# EAGLE schematic ADC (EAGLE 6.2)
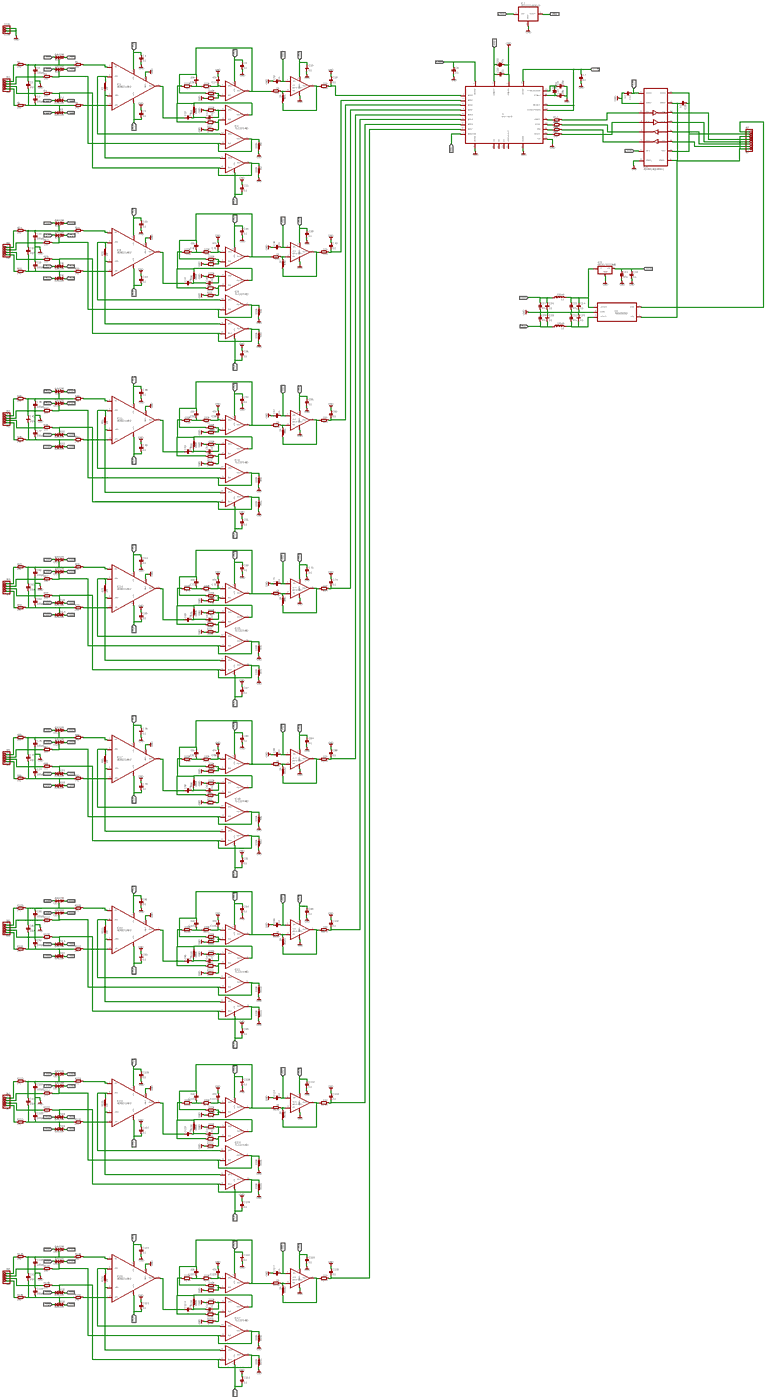
[diagram p0: schematic, sheet 1, overview]
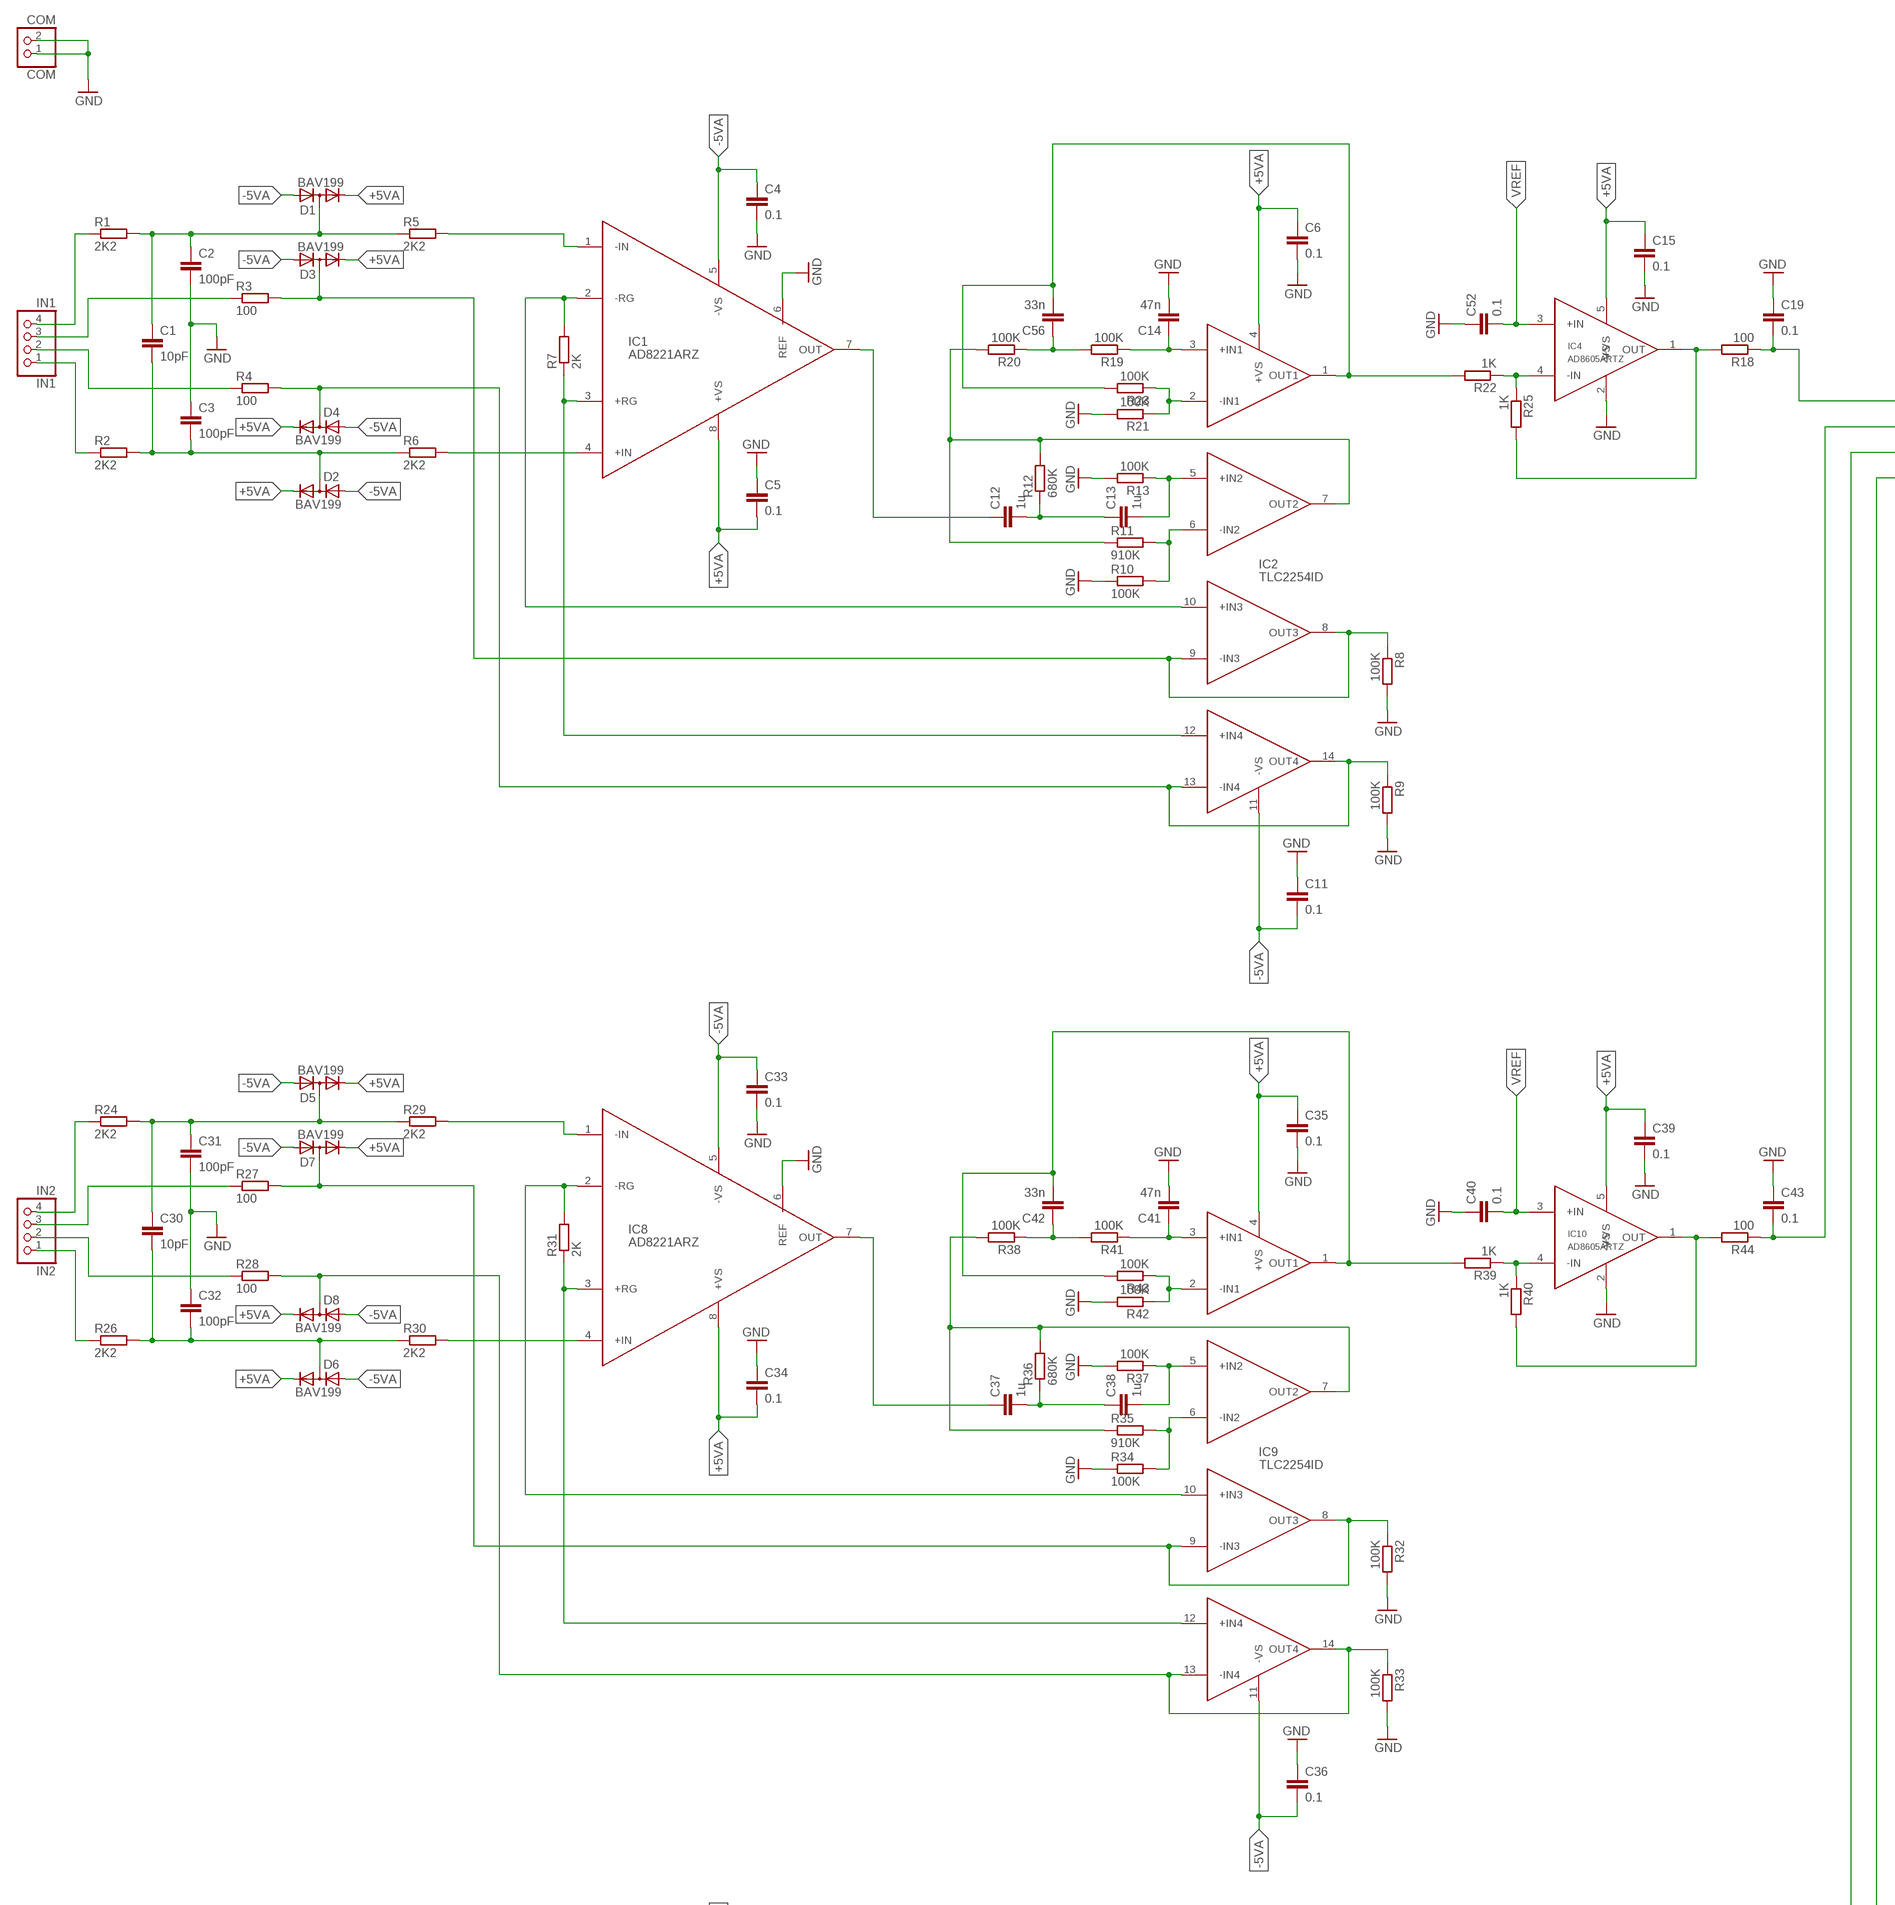
[diagram p1: schematic, sheet 1, part 1 of 5]
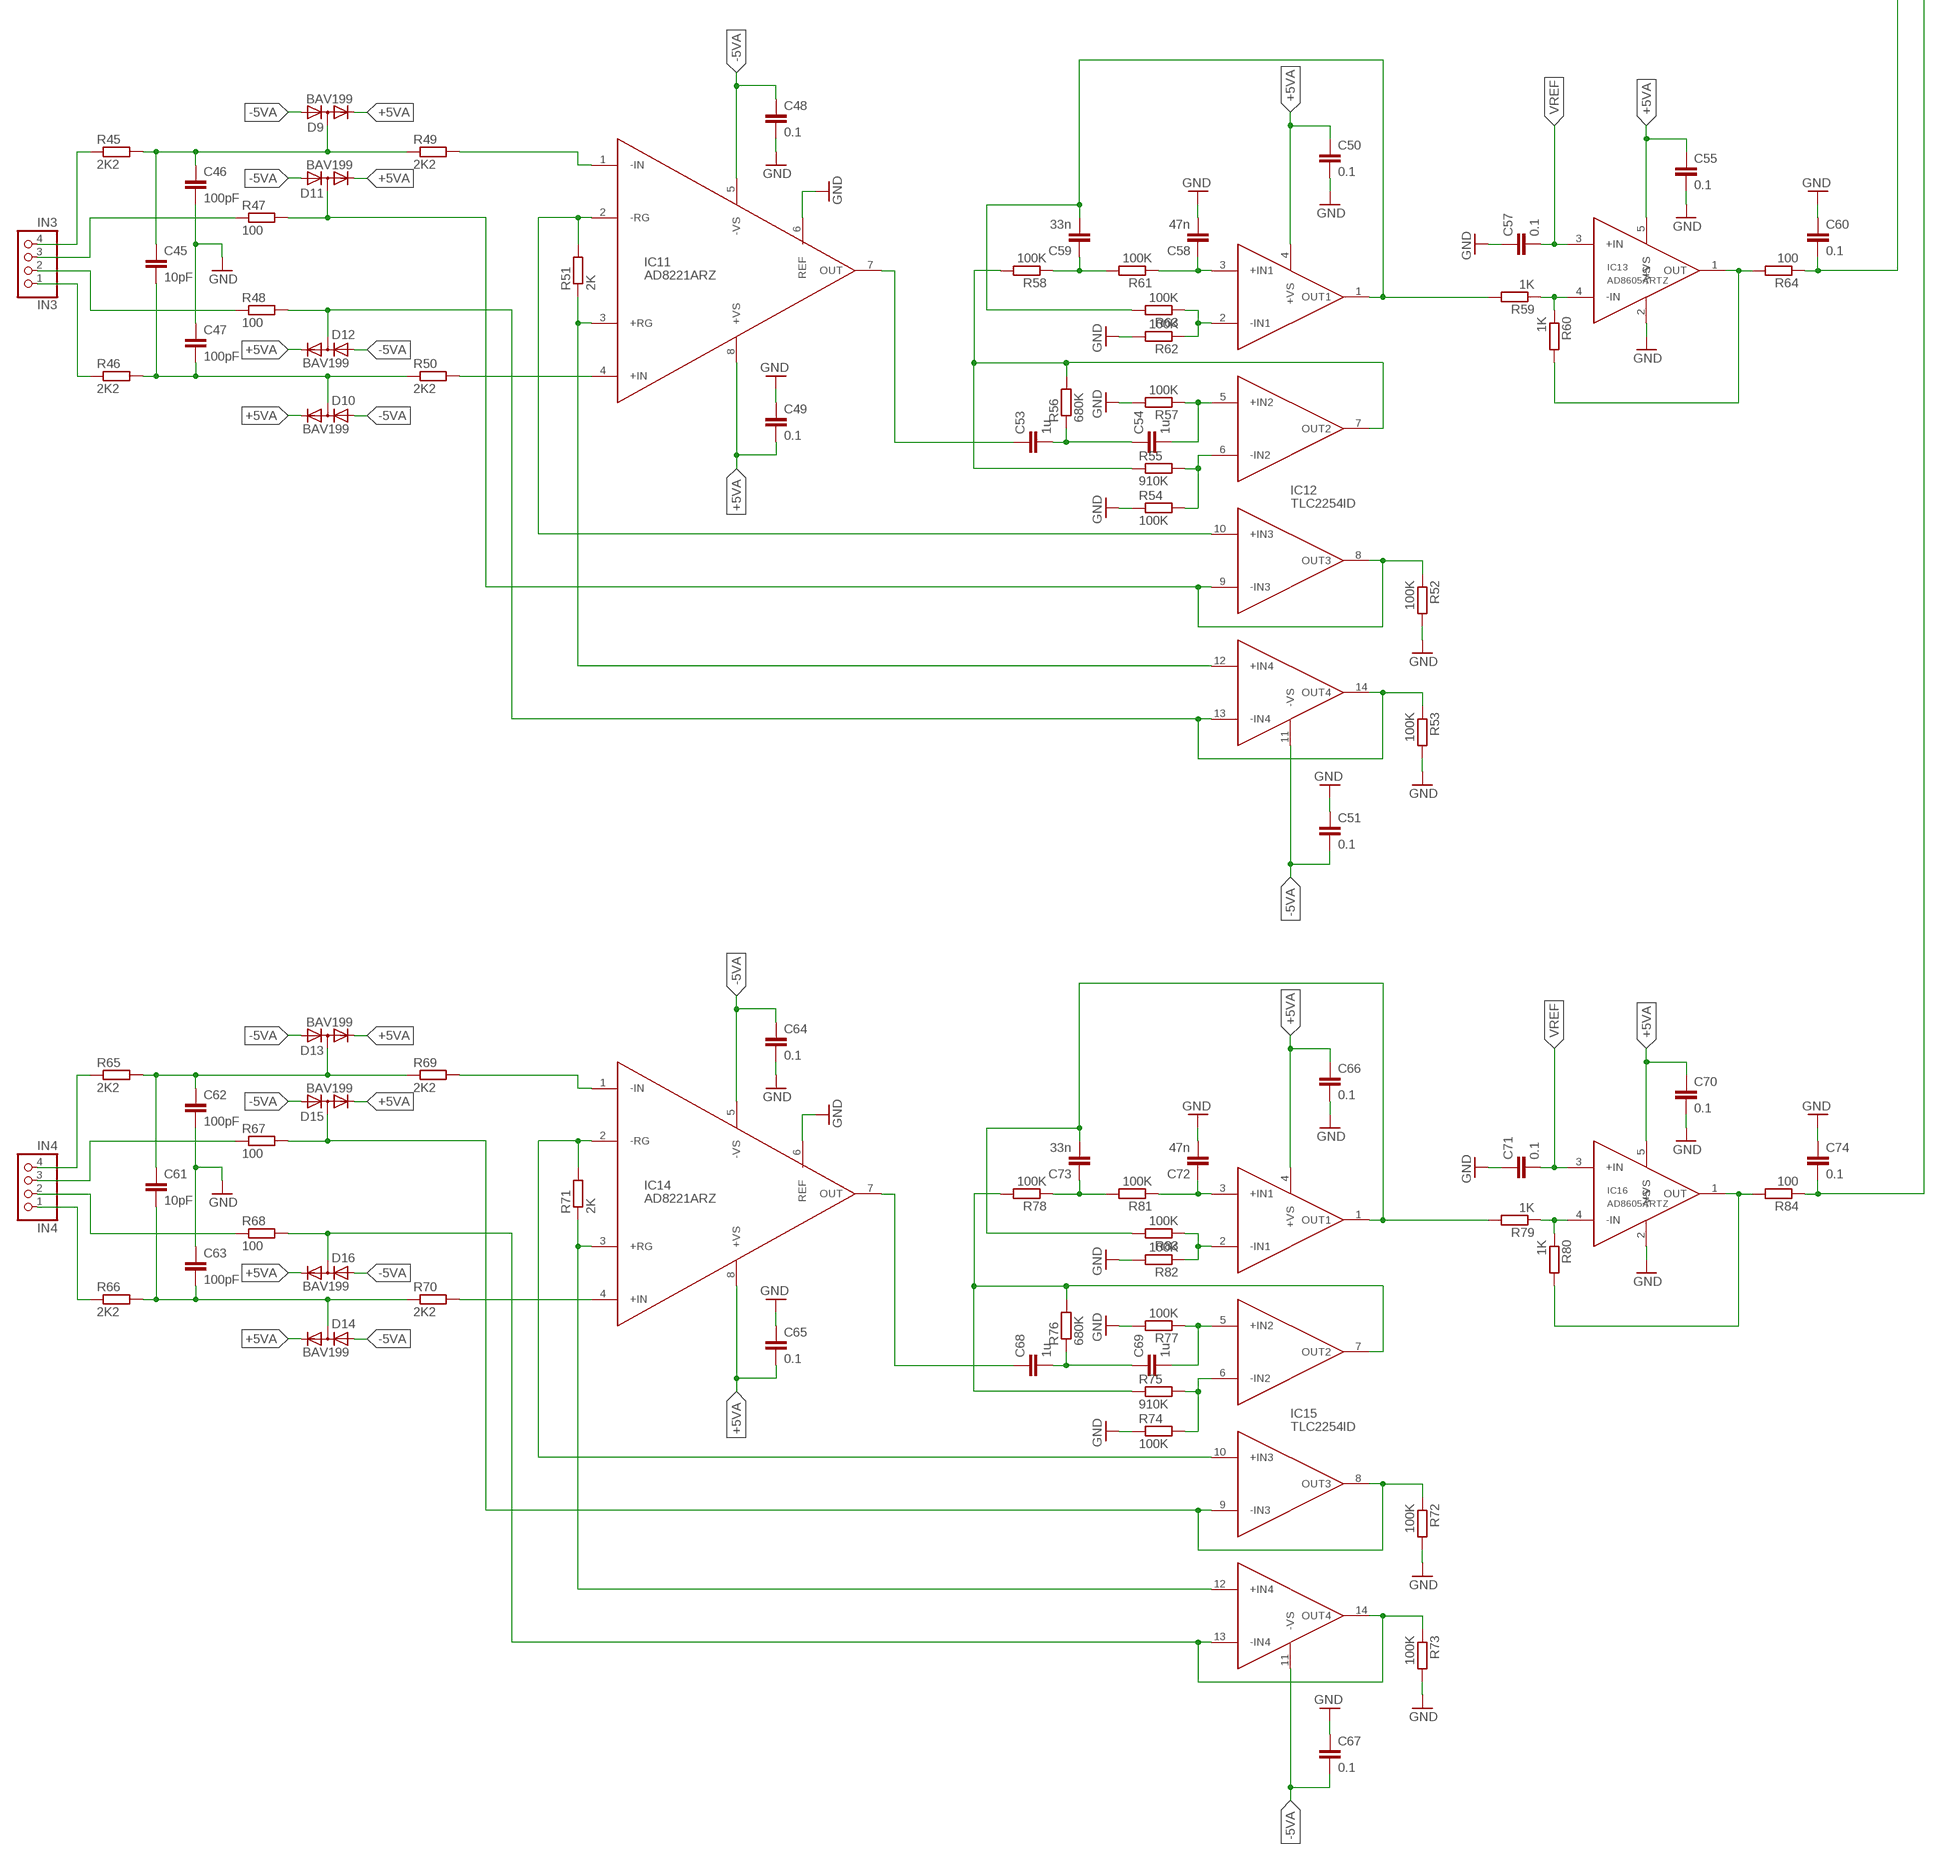
[diagram p2: schematic, sheet 1, part 2 of 5]
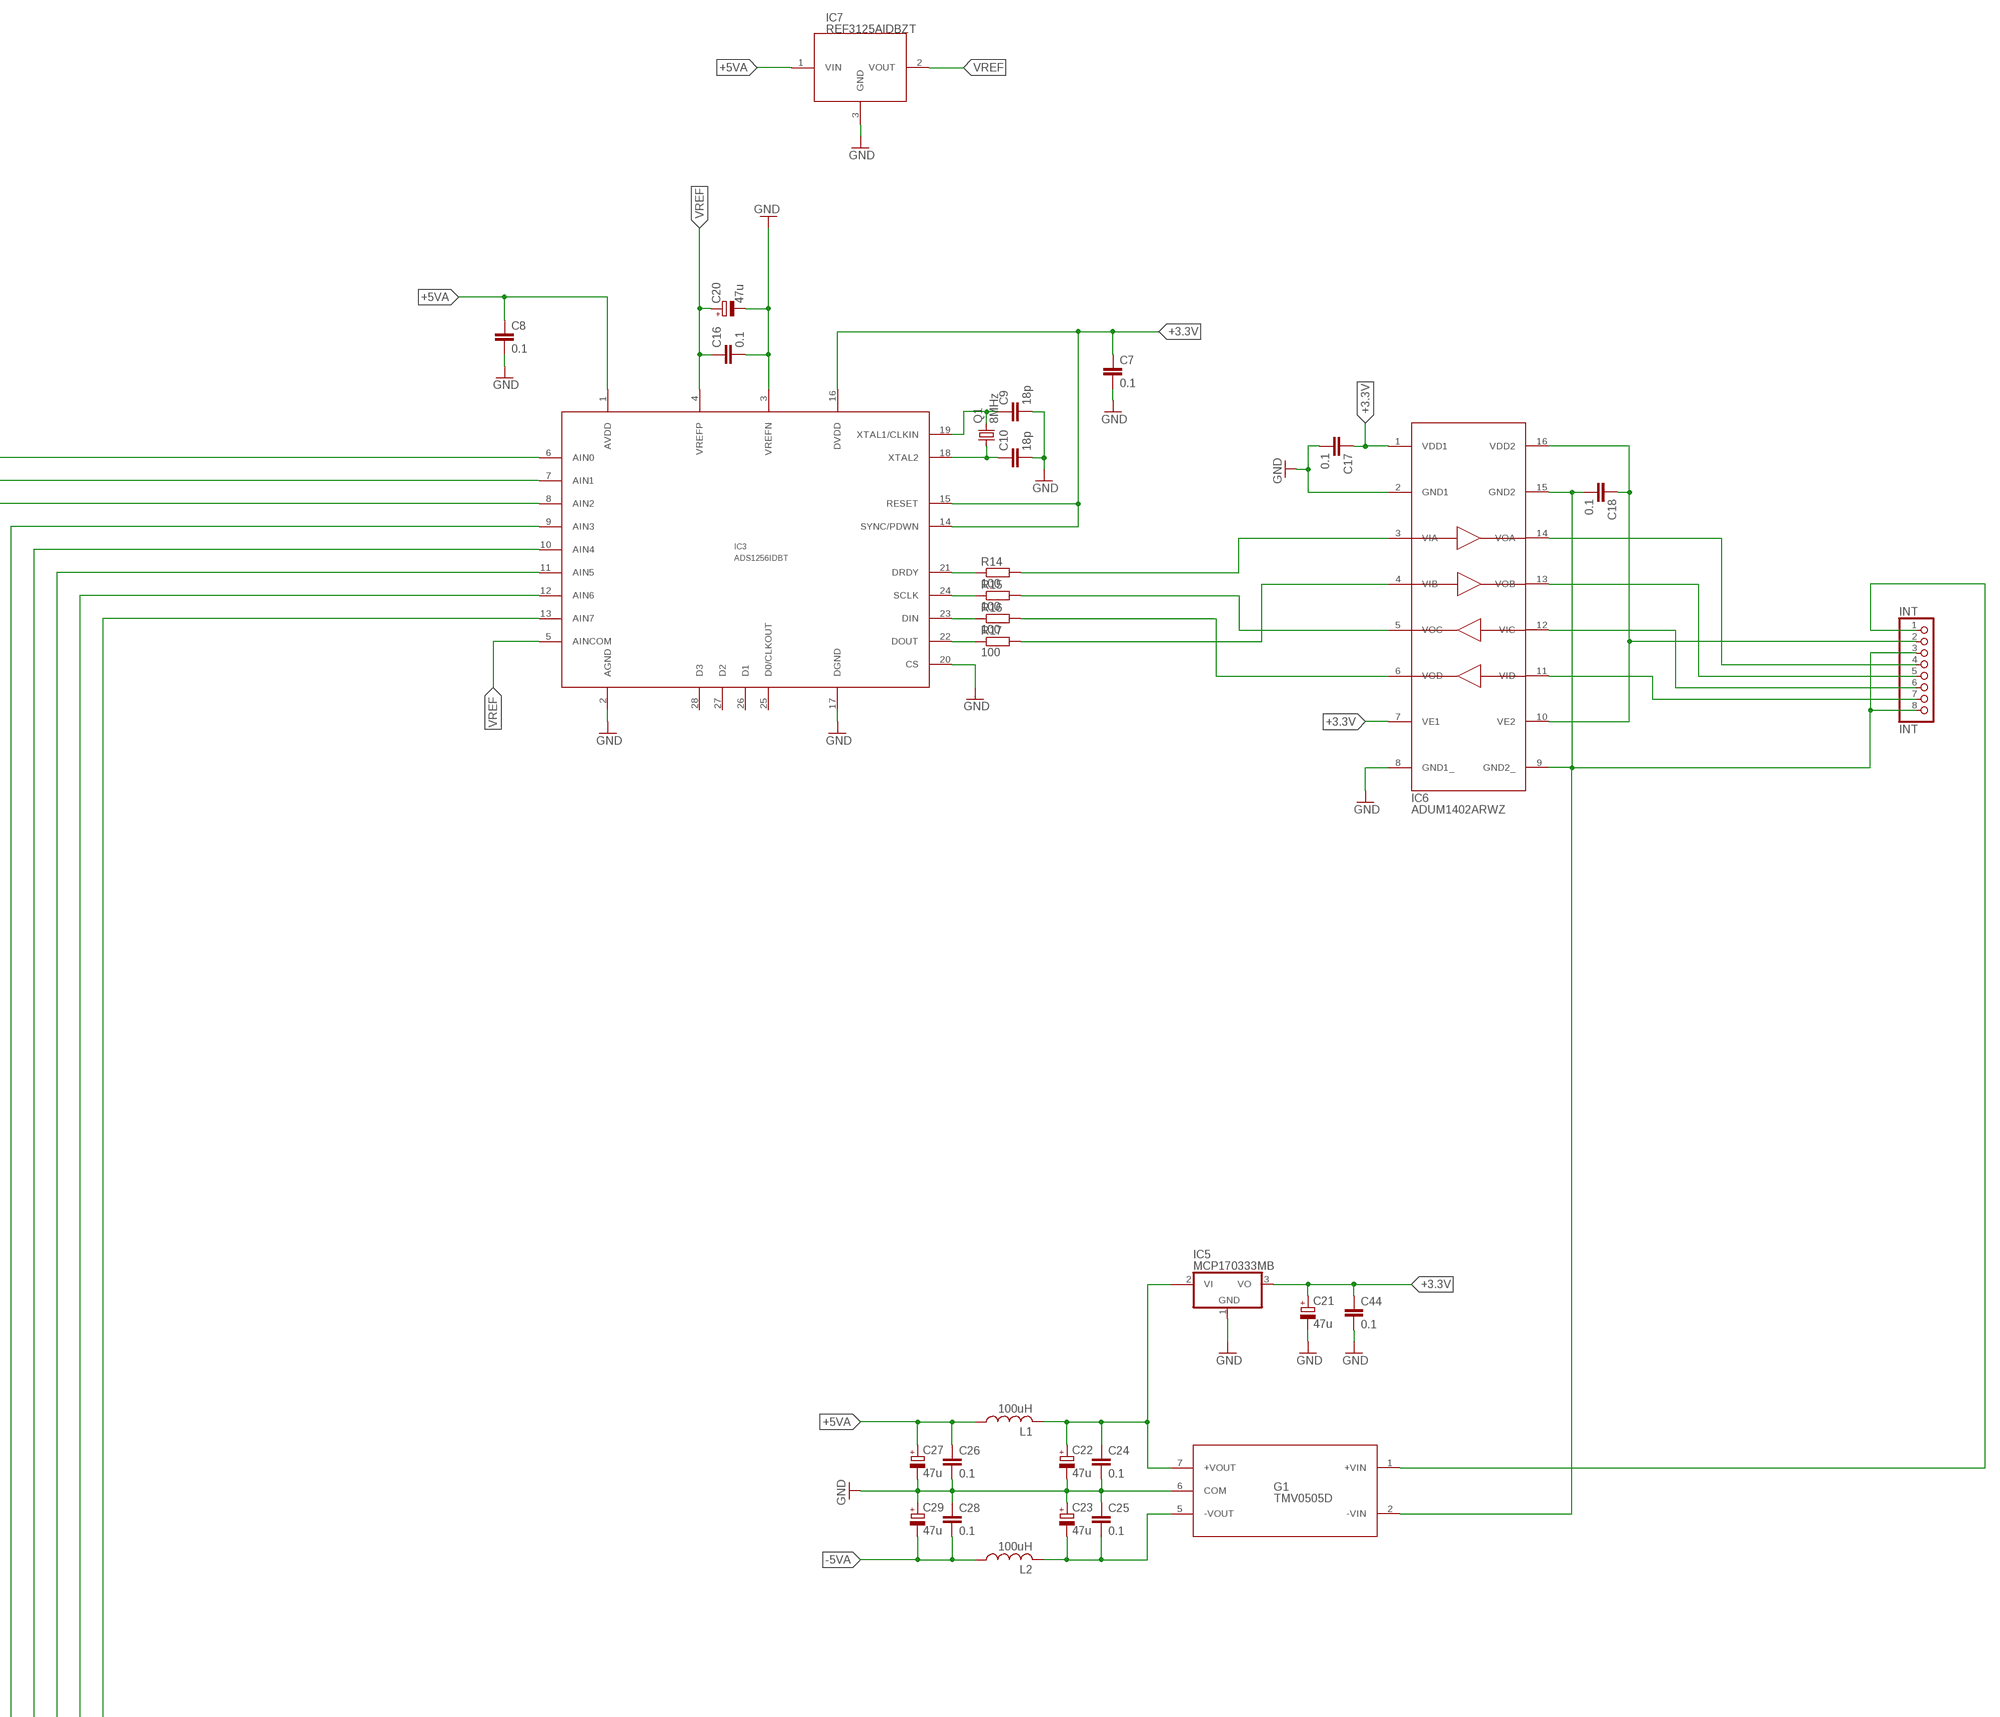
[diagram p3: schematic, sheet 1, part 3 of 5]
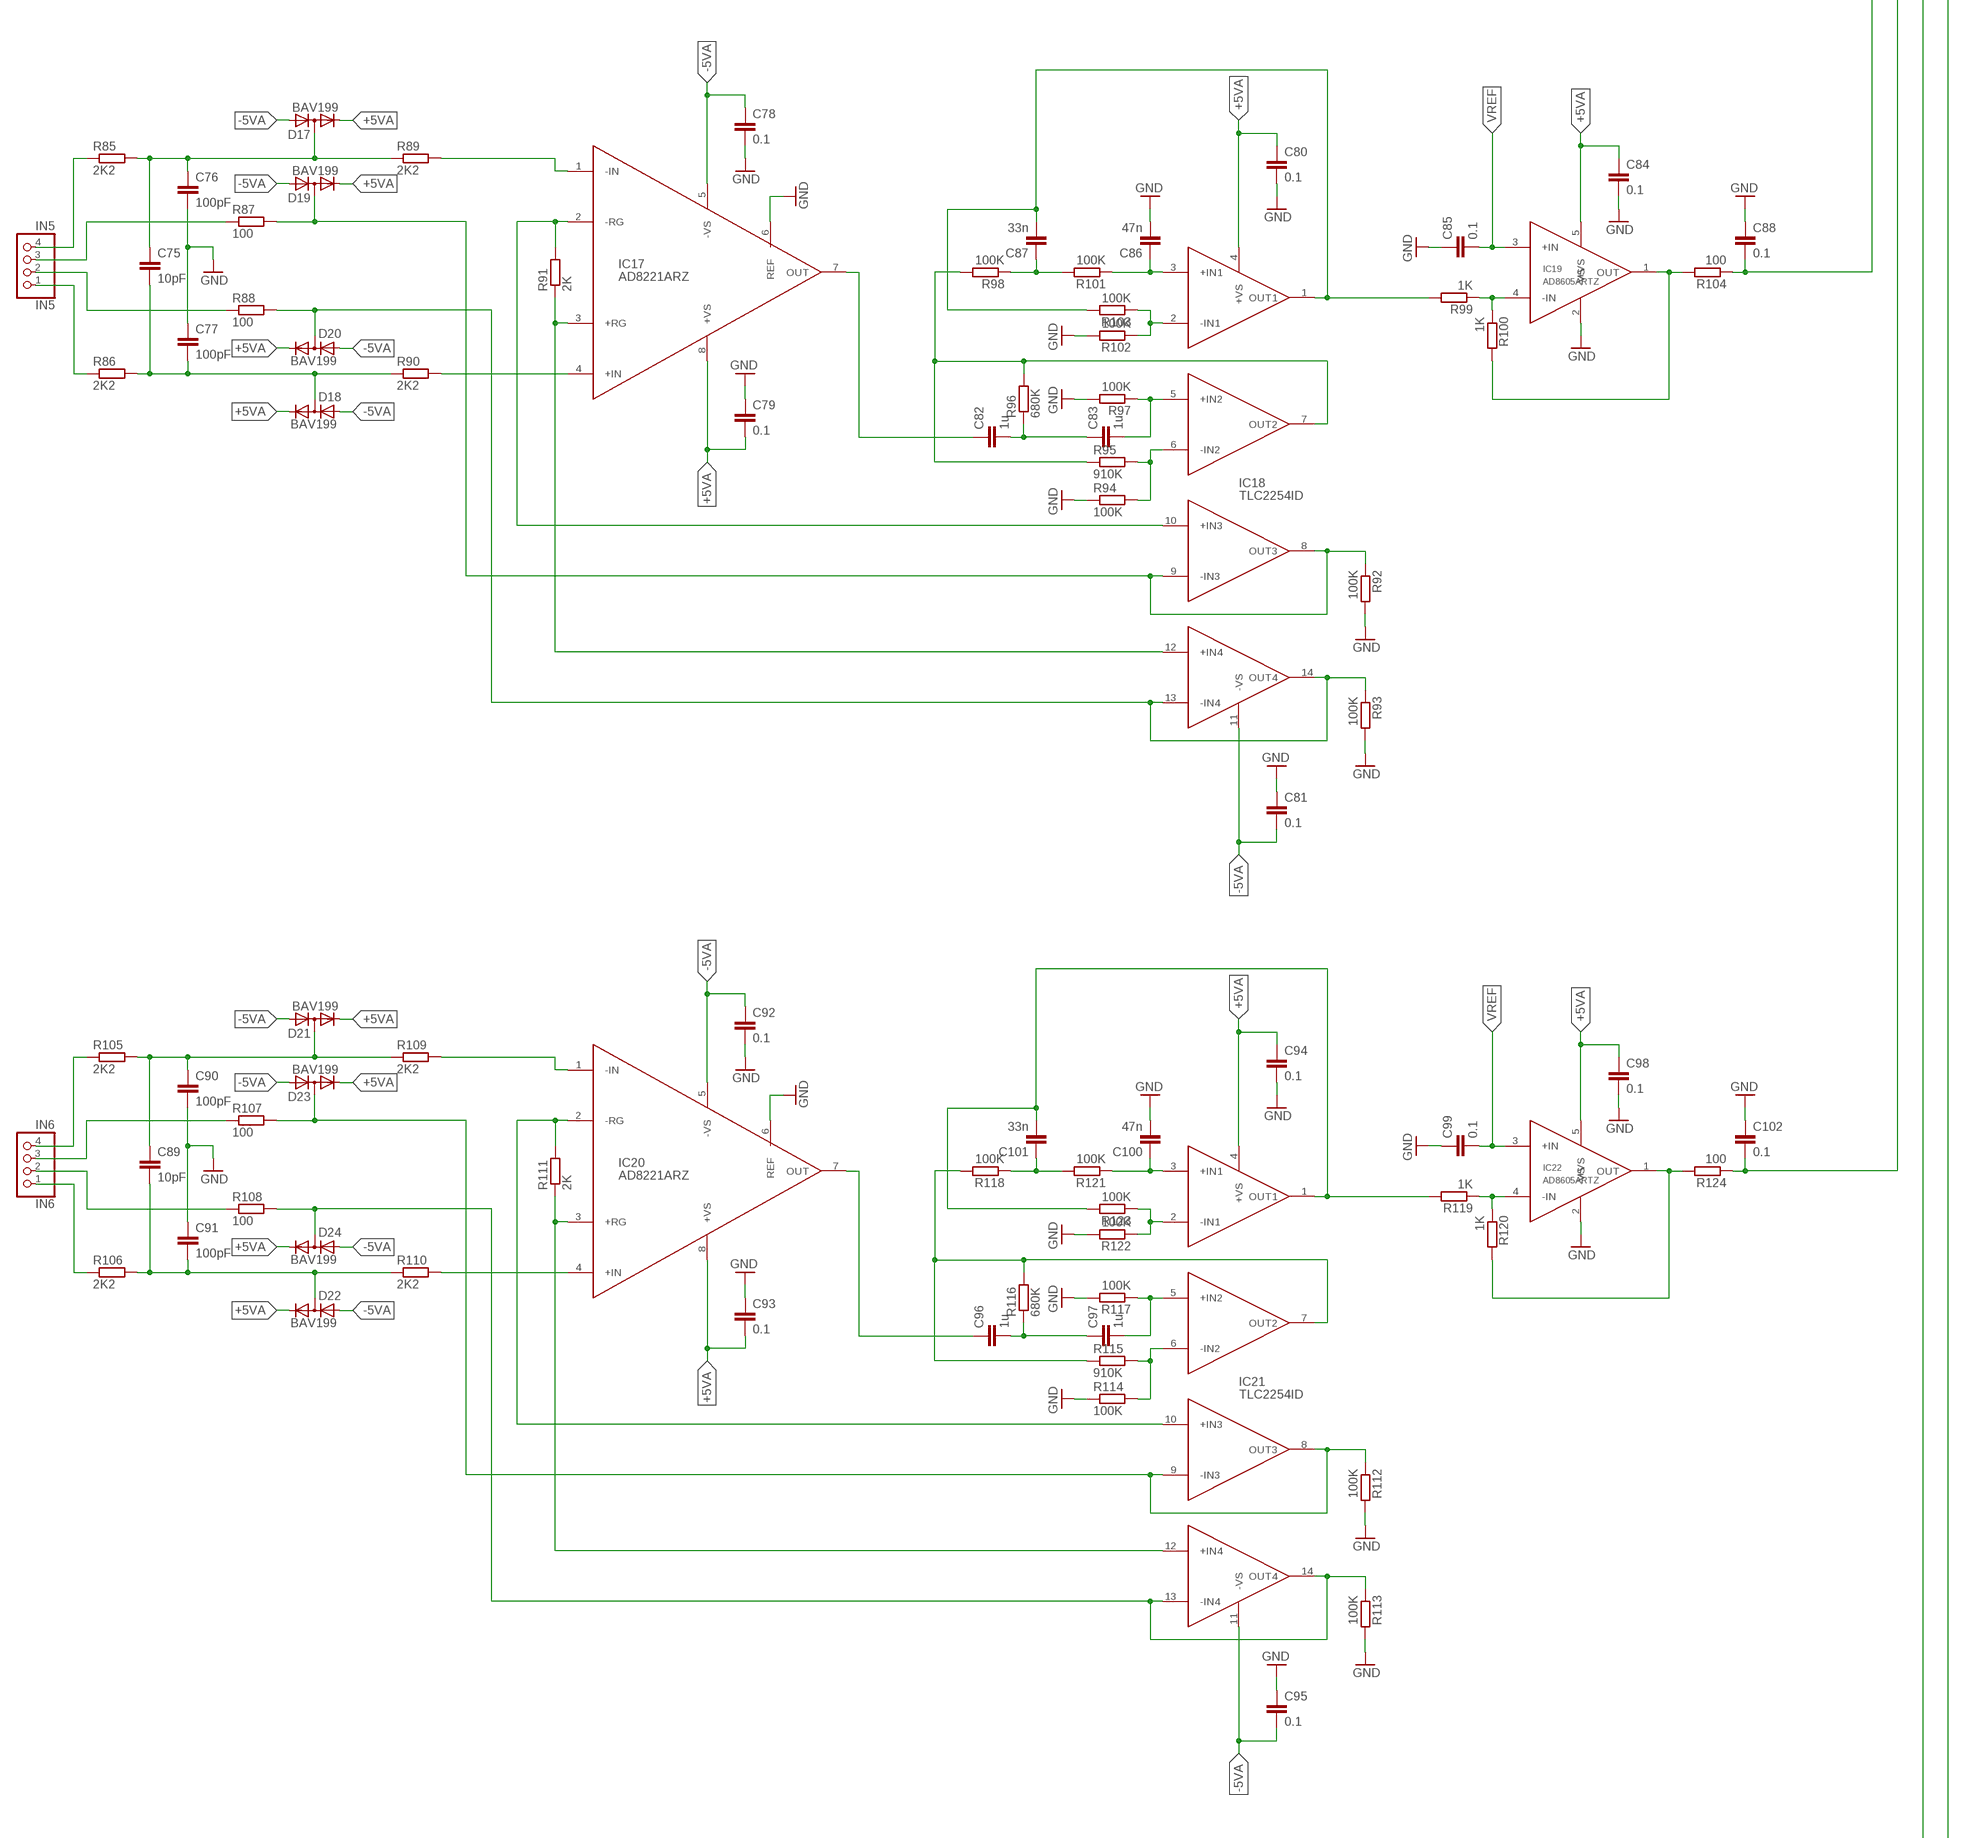
[diagram p4: schematic, sheet 1, part 4 of 5]
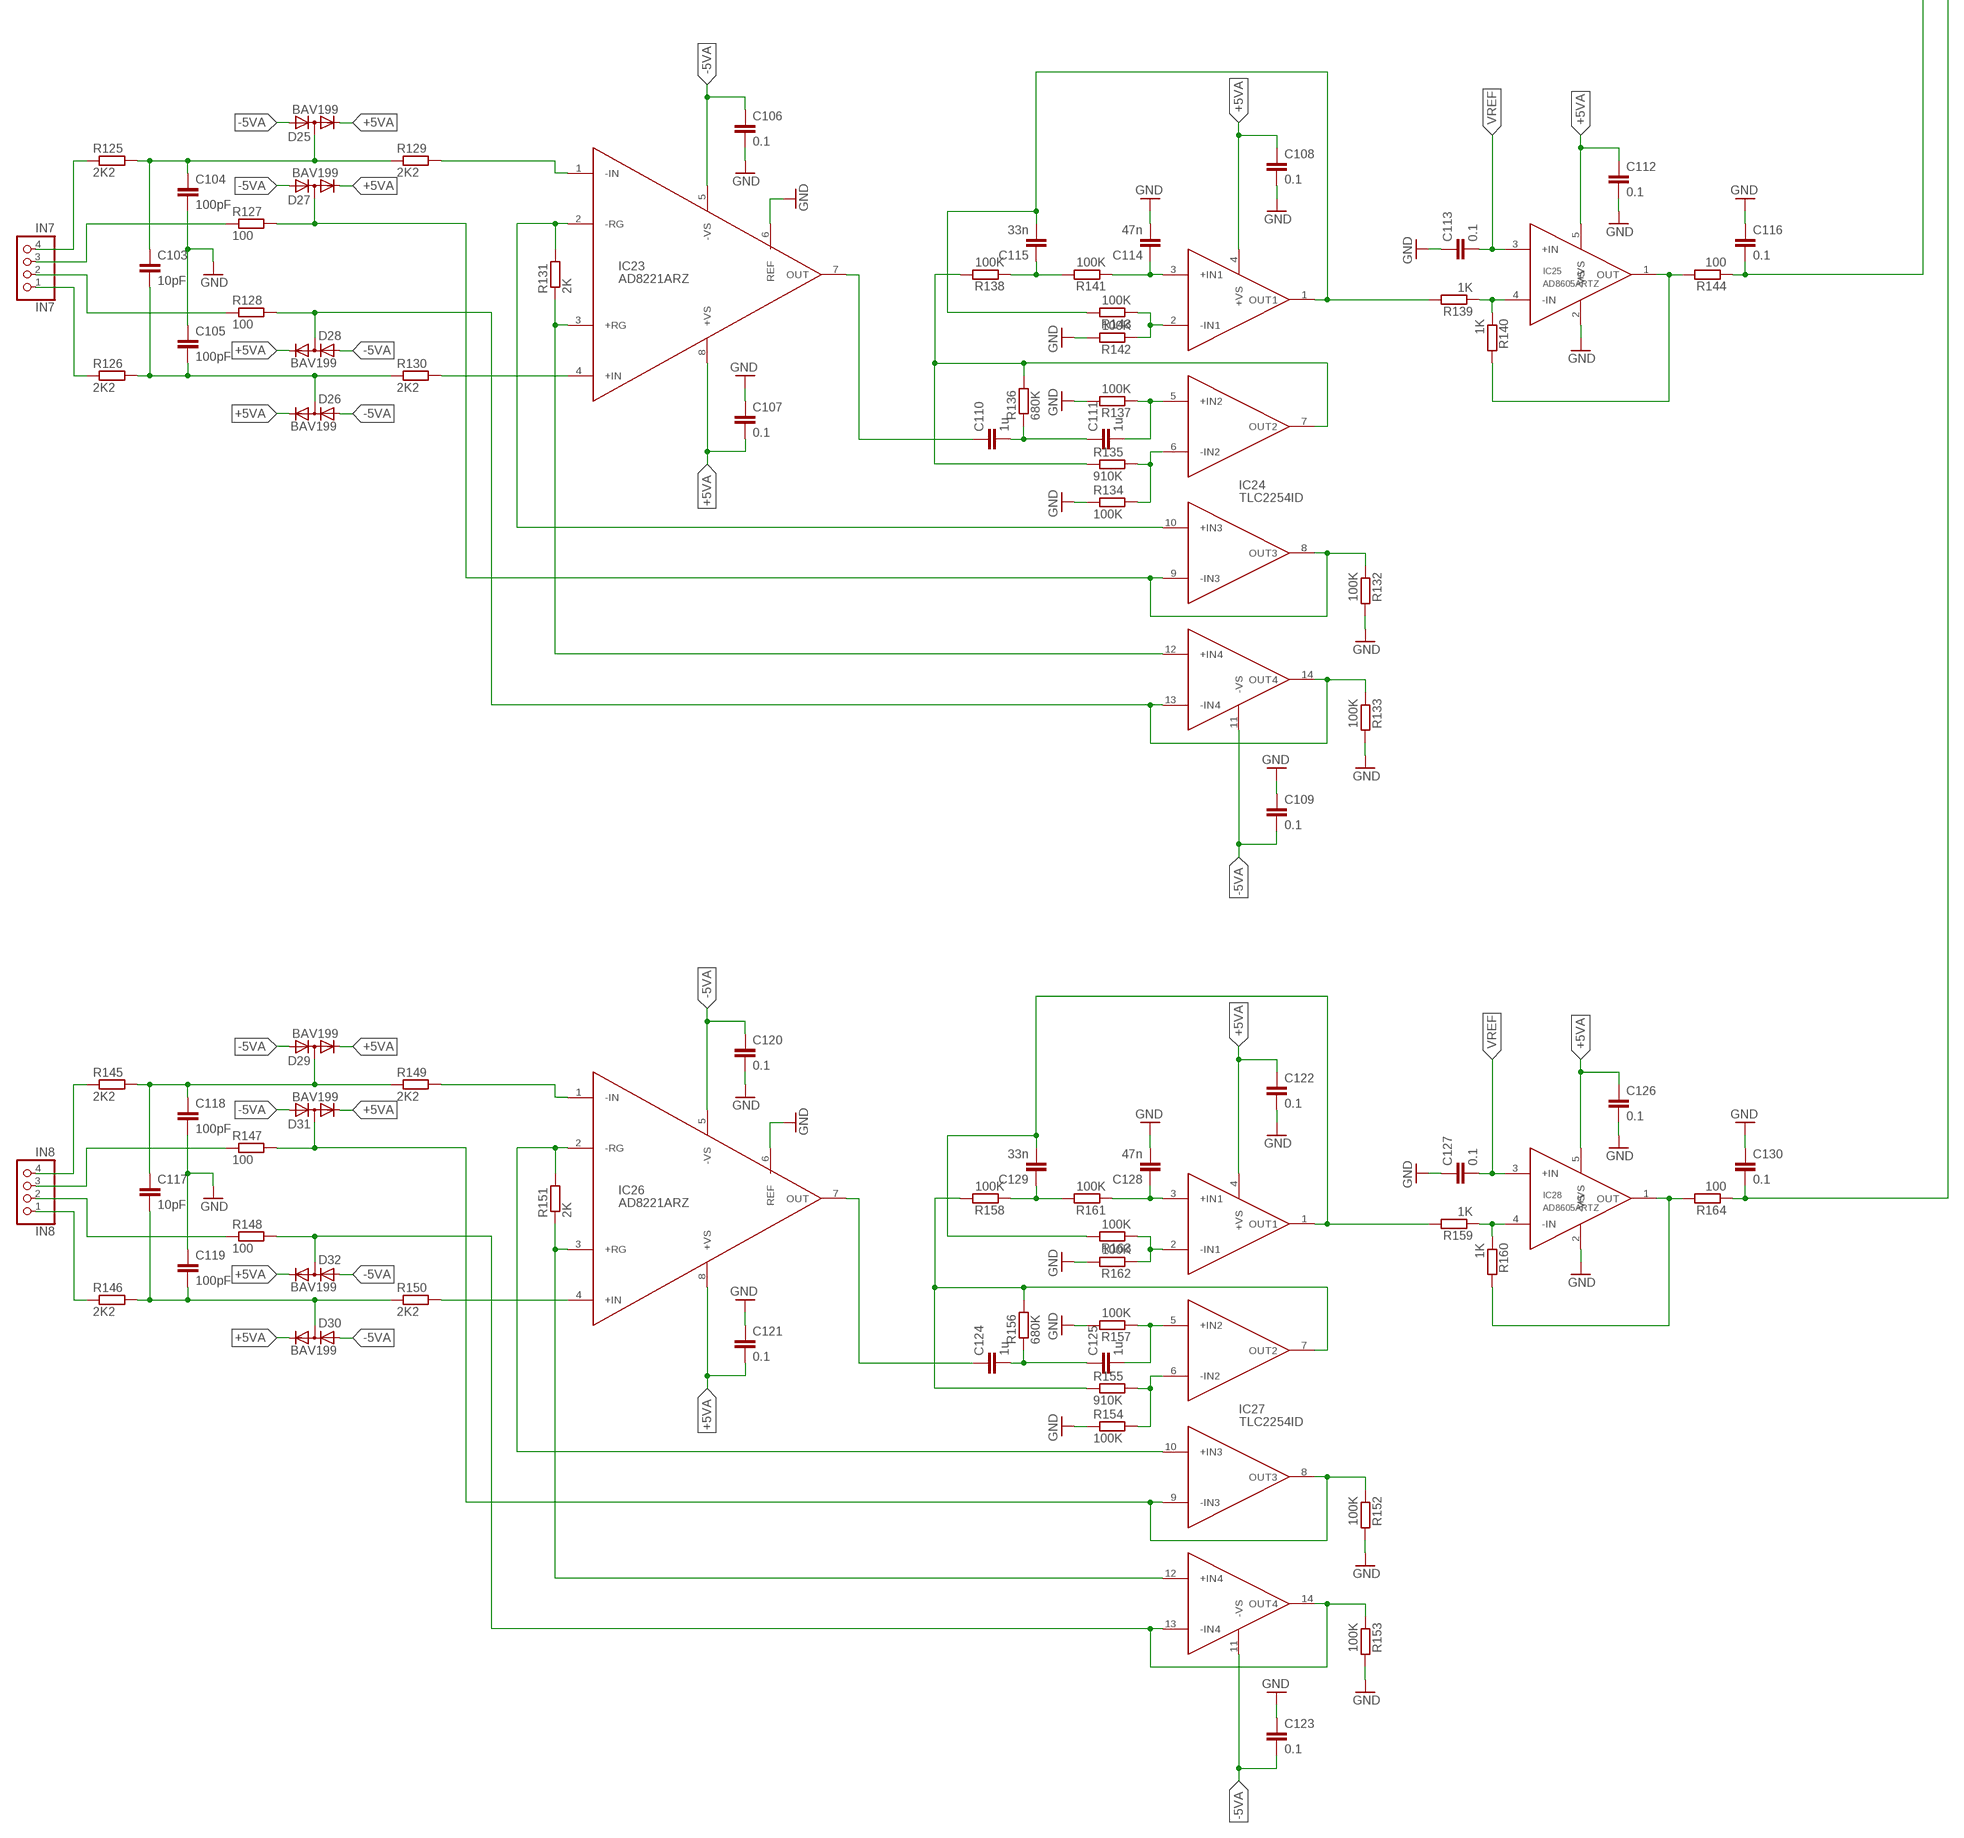
[diagram p5: schematic, sheet 1, part 5 of 5]

## Parts
C1  10pF  C-EUC0805  [C0805]
C2  100pF  C-EUC0805  [C0805]
C3  100pF  C-EUC0805  [C0805]
C4  0.1  C-EUC0805  [C0805]
C5  0.1  C-EUC0805  [C0805]
C6  0.1  C-EUC0805  [C0805]
C7  0.1  C-EUC0805  [C0805]
C8  0.1  C-EUC0805  [C0805]
C9  18p  C-EUC0805  [C0805]
C10  18p  C-EUC0805  [C0805]
C11  0.1  C-EUC0805  [C0805]
C12  1u  C-EUC0805  [C0805]
C13  1u  C-EUC0805  [C0805]
C14  47n  C-EUC0805  [C0805]
C15  0.1  C-EUC0805  [C0805]
C16  0.1  C-EUC0805  [C0805]
C17  0.1  C-EUC0805  [C0805]
C18  0.1  C-EUC0805  [C0805]
C19  0.1  C-EUC0805  [C0805]
C20  47u  CPOL-EUE2-4  [E2-4]
C21  47u  CPOL-EUE2-4  [E2-4]
C22  47u  CPOL-EUE2-4  [E2-4]
C23  47u  CPOL-EUE2-4  [E2-4]
C24  0.1  C-EUC0805  [C0805]
C25  0.1  C-EUC0805  [C0805]
C26  0.1  C-EUC0805  [C0805]
C27  47u  CPOL-EUE2-4  [E2-4]
C28  0.1  C-EUC0805  [C0805]
C29  47u  CPOL-EUE2-4  [E2-4]
C30  10pF  C-EUC0805  [C0805]
C31  100pF  C-EUC0805  [C0805]
C32  100pF  C-EUC0805  [C0805]
C33  0.1  C-EUC0805  [C0805]
C34  0.1  C-EUC0805  [C0805]
C35  0.1  C-EUC0805  [C0805]
C36  0.1  C-EUC0805  [C0805]
C37  1u  C-EUC0805  [C0805]
C38  1u  C-EUC0805  [C0805]
C39  0.1  C-EUC0805  [C0805]
C40  0.1  C-EUC0805  [C0805]
C41  47n  C-EUC0805  [C0805]
C42  33n  C-EUC0805  [C0805]
C43  0.1  C-EUC0805  [C0805]
C44  0.1  C-EUC0805  [C0805]
C45  10pF  C-EUC0805  [C0805]
C46  100pF  C-EUC0805  [C0805]
C47  100pF  C-EUC0805  [C0805]
C48  0.1  C-EUC0805  [C0805]
C49  0.1  C-EUC0805  [C0805]
C50  0.1  C-EUC0805  [C0805]
C51  0.1  C-EUC0805  [C0805]
C52  0.1  C-EUC0805  [C0805]
C53  1u  C-EUC0805  [C0805]
C54  1u  C-EUC0805  [C0805]
C55  0.1  C-EUC0805  [C0805]
C56  33n  C-EUC0805  [C0805]
C57  0.1  C-EUC0805  [C0805]
C58  47n  C-EUC0805  [C0805]
C59  33n  C-EUC0805  [C0805]
C60  0.1  C-EUC0805  [C0805]
C61  10pF  C-EUC0805  [C0805]
C62  100pF  C-EUC0805  [C0805]
C63  100pF  C-EUC0805  [C0805]
C64  0.1  C-EUC0805  [C0805]
C65  0.1  C-EUC0805  [C0805]
C66  0.1  C-EUC0805  [C0805]
C67  0.1  C-EUC0805  [C0805]
C68  1u  C-EUC0805  [C0805]
C69  1u  C-EUC0805  [C0805]
C70  0.1  C-EUC0805  [C0805]
C71  0.1  C-EUC0805  [C0805]
C72  47n  C-EUC0805  [C0805]
C73  33n  C-EUC0805  [C0805]
C74  0.1  C-EUC0805  [C0805]
C75  10pF  C-EUC0805  [C0805]
C76  100pF  C-EUC0805  [C0805]
C77  100pF  C-EUC0805  [C0805]
C78  0.1  C-EUC0805  [C0805]
C79  0.1  C-EUC0805  [C0805]
C80  0.1  C-EUC0805  [C0805]
C81  0.1  C-EUC0805  [C0805]
C82  1u  C-EUC0805  [C0805]
C83  1u  C-EUC0805  [C0805]
C84  0.1  C-EUC0805  [C0805]
C85  0.1  C-EUC0805  [C0805]
C86  47n  C-EUC0805  [C0805]
C87  33n  C-EUC0805  [C0805]
C88  0.1  C-EUC0805  [C0805]
C89  10pF  C-EUC0805  [C0805]
C90  100pF  C-EUC0805  [C0805]
C91  100pF  C-EUC0805  [C0805]
C92  0.1  C-EUC0805  [C0805]
C93  0.1  C-EUC0805  [C0805]
C94  0.1  C-EUC0805  [C0805]
C95  0.1  C-EUC0805  [C0805]
C96  1u  C-EUC0805  [C0805]
C97  1u  C-EUC0805  [C0805]
C98  0.1  C-EUC0805  [C0805]
C99  0.1  C-EUC0805  [C0805]
C100  47n  C-EUC0805  [C0805]
C101  33n  C-EUC0805  [C0805]
C102  0.1  C-EUC0805  [C0805]
C103  10pF  C-EUC0805  [C0805]
C104  100pF  C-EUC0805  [C0805]
C105  100pF  C-EUC0805  [C0805]
C106  0.1  C-EUC0805  [C0805]
C107  0.1  C-EUC0805  [C0805]
C108  0.1  C-EUC0805  [C0805]
C109  0.1  C-EUC0805  [C0805]
C110  1u  C-EUC0805  [C0805]
C111  1u  C-EUC0805  [C0805]
C112  0.1  C-EUC0805  [C0805]
C113  0.1  C-EUC0805  [C0805]
C114  47n  C-EUC0805  [C0805]
C115  33n  C-EUC0805  [C0805]
C116  0.1  C-EUC0805  [C0805]
C117  10pF  C-EUC0805  [C0805]
C118  100pF  C-EUC0805  [C0805]
C119  100pF  C-EUC0805  [C0805]
C120  0.1  C-EUC0805  [C0805]
C121  0.1  C-EUC0805  [C0805]
C122  0.1  C-EUC0805  [C0805]
C123  0.1  C-EUC0805  [C0805]
C124  1u  C-EUC0805  [C0805]
C125  1u  C-EUC0805  [C0805]
C126  0.1  C-EUC0805  [C0805]
C127  0.1  C-EUC0805  [C0805]
C128  47n  C-EUC0805  [C0805]
C129  33n  C-EUC0805  [C0805]
C130  0.1  C-EUC0805  [C0805]
COM  COM  PINHD-1X2  [1X02]
D1  BAV199  [SOT23]
D2  BAV199  [SOT23]
D3  BAV199  [SOT23]
D4  BAV199  [SOT23]
D5  BAV199  [SOT23]
D6  BAV199  [SOT23]
D7  BAV199  [SOT23]
D8  BAV199  [SOT23]
D9  BAV199  [SOT23]
D10  BAV199  [SOT23]
D11  BAV199  [SOT23]
D12  BAV199  [SOT23]
D13  BAV199  [SOT23]
D14  BAV199  [SOT23]
D15  BAV199  [SOT23]
D16  BAV199  [SOT23]
D17  BAV199  [SOT23]
D18  BAV199  [SOT23]
D19  BAV199  [SOT23]
D20  BAV199  [SOT23]
D21  BAV199  [SOT23]
D22  BAV199  [SOT23]
D23  BAV199  [SOT23]
D24  BAV199  [SOT23]
D25  BAV199  [SOT23]
D26  BAV199  [SOT23]
D27  BAV199  [SOT23]
D28  BAV199  [SOT23]
D29  BAV199  [SOT23]
D30  BAV199  [SOT23]
D31  BAV199  [SOT23]
D32  BAV199  [SOT23]
G1  TMV0505D  [TMV0505D]
IC1  AD8221ARZ  [SO-08]
IC2  TLC2254ID  [TLC2254ID]
IC3  ADS1256IDBT  [ADS1256IDBT]
IC4  AD8605ARTZ  [AD8605ARTZ]
IC5  MCP170333MB  [SOT89]
IC6  ADUM1402ARWZ  [ADUM1402ARWZ]
IC7  REF3125AIDBZT  [REF3125AIDBZT]
IC8  AD8221ARZ  [SO-08]
IC9  TLC2254ID  [TLC2254ID]
IC10  AD8605ARTZ  [AD8605ARTZ]
IC11  AD8221ARZ  [SO-08]
IC12  TLC2254ID  [TLC2254ID]
IC13  AD8605ARTZ  [AD8605ARTZ]
IC14  AD8221ARZ  [SO-08]
IC15  TLC2254ID  [TLC2254ID]
IC16  AD8605ARTZ  [AD8605ARTZ]
IC17  AD8221ARZ  [SO-08]
IC18  TLC2254ID  [TLC2254ID]
IC19  AD8605ARTZ  [AD8605ARTZ]
IC20  AD8221ARZ  [SO-08]
IC21  TLC2254ID  [TLC2254ID]
IC22  AD8605ARTZ  [AD8605ARTZ]
IC23  AD8221ARZ  [SO-08]
IC24  TLC2254ID  [TLC2254ID]
IC25  AD8605ARTZ  [AD8605ARTZ]
IC26  AD8221ARZ  [SO-08]
IC27  TLC2254ID  [TLC2254ID]
IC28  AD8605ARTZ  [AD8605ARTZ]
IN1  IN1  PINHD-1X4  [1X04]
IN2  IN2  PINHD-1X4  [1X04]
IN3  IN3  PINHD-1X4  [1X04]
IN4  IN4  PINHD-1X4  [1X04]
IN5  IN5  PINHD-1X4  [1X04]
IN6  IN6  PINHD-1X4  [1X04]
IN7  IN7  PINHD-1X4  [1X04]
IN8  IN8  PINHD-1X4  [1X04]
INT  INT  PINHD-1X8  [1X08]
L1  100uH  L-USL4532P  [L4532P]
L2  100uH  L-USL4532P  [L4532P]
Q1  8MHz  CRYSTALHC49U-V  [HC49U-V]
R1  2K2  R-EU_R0805  [R0805]
R2  2K2  R-EU_R0805  [R0805]
R3  100  R-EU_R0805  [R0805]
R4  100  R-EU_R0805  [R0805]
R5  2K2  R-EU_R0805  [R0805]
R6  2K2  R-EU_R0805  [R0805]
R7  2K  R-EU_R0805  [R0805]
R8  100K  R-EU_R0805  [R0805]
R9  100K  R-EU_R0805  [R0805]
R10  100K  R-EU_R0805  [R0805]
R11  910K  R-EU_R0805  [R0805]
R12  680K  R-EU_R0805  [R0805]
R13  100K  R-EU_R0805  [R0805]
R14  100  R-EU_R0805  [R0805]
R15  100  R-EU_R0805  [R0805]
R16  100  R-EU_R0805  [R0805]
R17  100  R-EU_R0805  [R0805]
R18  100  R-EU_R0805  [R0805]
R19  100K  R-EU_R0805  [R0805]
R20  100K  R-EU_R0805  [R0805]
R21  100K  R-EU_R0805  [R0805]
R22  1K  R-EU_R0805  [R0805]
R23  100K  R-EU_R0805  [R0805]
R24  2K2  R-EU_R0805  [R0805]
R25  1K  R-EU_R0805  [R0805]
R26  2K2  R-EU_R0805  [R0805]
R27  100  R-EU_R0805  [R0805]
R28  100  R-EU_R0805  [R0805]
R29  2K2  R-EU_R0805  [R0805]
R30  2K2  R-EU_R0805  [R0805]
R31  2K  R-EU_R0805  [R0805]
R32  100K  R-EU_R0805  [R0805]
R33  100K  R-EU_R0805  [R0805]
R34  100K  R-EU_R0805  [R0805]
R35  910K  R-EU_R0805  [R0805]
R36  680K  R-EU_R0805  [R0805]
R37  100K  R-EU_R0805  [R0805]
R38  100K  R-EU_R0805  [R0805]
R39  1K  R-EU_R0805  [R0805]
R40  1K  R-EU_R0805  [R0805]
R41  100K  R-EU_R0805  [R0805]
R42  100K  R-EU_R0805  [R0805]
R43  100K  R-EU_R0805  [R0805]
R44  100  R-EU_R0805  [R0805]
R45  2K2  R-EU_R0805  [R0805]
R46  2K2  R-EU_R0805  [R0805]
R47  100  R-EU_R0805  [R0805]
R48  100  R-EU_R0805  [R0805]
R49  2K2  R-EU_R0805  [R0805]
R50  2K2  R-EU_R0805  [R0805]
R51  2K  R-EU_R0805  [R0805]
R52  100K  R-EU_R0805  [R0805]
R53  100K  R-EU_R0805  [R0805]
R54  100K  R-EU_R0805  [R0805]
R55  910K  R-EU_R0805  [R0805]
R56  680K  R-EU_R0805  [R0805]
R57  100K  R-EU_R0805  [R0805]
R58  100K  R-EU_R0805  [R0805]
R59  1K  R-EU_R0805  [R0805]
R60  1K  R-EU_R0805  [R0805]
R61  100K  R-EU_R0805  [R0805]
R62  100K  R-EU_R0805  [R0805]
R63  100K  R-EU_R0805  [R0805]
R64  100  R-EU_R0805  [R0805]
R65  2K2  R-EU_R0805  [R0805]
R66  2K2  R-EU_R0805  [R0805]
R67  100  R-EU_R0805  [R0805]
R68  100  R-EU_R0805  [R0805]
R69  2K2  R-EU_R0805  [R0805]
R70  2K2  R-EU_R0805  [R0805]
R71  2K  R-EU_R0805  [R0805]
R72  100K  R-EU_R0805  [R0805]
R73  100K  R-EU_R0805  [R0805]
R74  100K  R-EU_R0805  [R0805]
R75  910K  R-EU_R0805  [R0805]
R76  680K  R-EU_R0805  [R0805]
R77  100K  R-EU_R0805  [R0805]
R78  100K  R-EU_R0805  [R0805]
R79  1K  R-EU_R0805  [R0805]
R80  1K  R-EU_R0805  [R0805]
R81  100K  R-EU_R0805  [R0805]
R82  100K  R-EU_R0805  [R0805]
R83  100K  R-EU_R0805  [R0805]
R84  100  R-EU_R0805  [R0805]
R85  2K2  R-EU_R0805  [R0805]
R86  2K2  R-EU_R0805  [R0805]
R87  100  R-EU_R0805  [R0805]
R88  100  R-EU_R0805  [R0805]
R89  2K2  R-EU_R0805  [R0805]
R90  2K2  R-EU_R0805  [R0805]
R91  2K  R-EU_R0805  [R0805]
R92  100K  R-EU_R0805  [R0805]
R93  100K  R-EU_R0805  [R0805]
R94  100K  R-EU_R0805  [R0805]
R95  910K  R-EU_R0805  [R0805]
R96  680K  R-EU_R0805  [R0805]
R97  100K  R-EU_R0805  [R0805]
R98  100K  R-EU_R0805  [R0805]
R99  1K  R-EU_R0805  [R0805]
R100  1K  R-EU_R0805  [R0805]
R101  100K  R-EU_R0805  [R0805]
R102  100K  R-EU_R0805  [R0805]
R103  100K  R-EU_R0805  [R0805]
R104  100  R-EU_R0805  [R0805]
R105  2K2  R-EU_R0805  [R0805]
R106  2K2  R-EU_R0805  [R0805]
R107  100  R-EU_R0805  [R0805]
R108  100  R-EU_R0805  [R0805]
R109  2K2  R-EU_R0805  [R0805]
R110  2K2  R-EU_R0805  [R0805]
R111  2K  R-EU_R0805  [R0805]
R112  100K  R-EU_R0805  [R0805]
R113  100K  R-EU_R0805  [R0805]
R114  100K  R-EU_R0805  [R0805]
R115  910K  R-EU_R0805  [R0805]
R116  680K  R-EU_R0805  [R0805]
R117  100K  R-EU_R0805  [R0805]
R118  100K  R-EU_R0805  [R0805]
R119  1K  R-EU_R0805  [R0805]
R120  1K  R-EU_R0805  [R0805]
R121  100K  R-EU_R0805  [R0805]
R122  100K  R-EU_R0805  [R0805]
R123  100K  R-EU_R0805  [R0805]
R124  100  R-EU_R0805  [R0805]
R125  2K2  R-EU_R0805  [R0805]
R126  2K2  R-EU_R0805  [R0805]
R127  100  R-EU_R0805  [R0805]
R128  100  R-EU_R0805  [R0805]
R129  2K2  R-EU_R0805  [R0805]
R130  2K2  R-EU_R0805  [R0805]
R131  2K  R-EU_R0805  [R0805]
R132  100K  R-EU_R0805  [R0805]
R133  100K  R-EU_R0805  [R0805]
R134  100K  R-EU_R0805  [R0805]
R135  910K  R-EU_R0805  [R0805]
R136  680K  R-EU_R0805  [R0805]
R137  100K  R-EU_R0805  [R0805]
R138  100K  R-EU_R0805  [R0805]
R139  1K  R-EU_R0805  [R0805]
R140  1K  R-EU_R0805  [R0805]
R141  100K  R-EU_R0805  [R0805]
R142  100K  R-EU_R0805  [R0805]
R143  100K  R-EU_R0805  [R0805]
R144  100  R-EU_R0805  [R0805]
R145  2K2  R-EU_R0805  [R0805]
R146  2K2  R-EU_R0805  [R0805]
R147  100  R-EU_R0805  [R0805]
R148  100  R-EU_R0805  [R0805]
R149  2K2  R-EU_R0805  [R0805]
R150  2K2  R-EU_R0805  [R0805]
R151  2K  R-EU_R0805  [R0805]
R152  100K  R-EU_R0805  [R0805]
R153  100K  R-EU_R0805  [R0805]
R154  100K  R-EU_R0805  [R0805]
R155  910K  R-EU_R0805  [R0805]
R156  680K  R-EU_R0805  [R0805]
R157  100K  R-EU_R0805  [R0805]
R158  100K  R-EU_R0805  [R0805]
R159  1K  R-EU_R0805  [R0805]
R160  1K  R-EU_R0805  [R0805]
R161  100K  R-EU_R0805  [R0805]
R162  100K  R-EU_R0805  [R0805]
R163  100K  R-EU_R0805  [R0805]
R164  100  R-EU_R0805  [R0805]

## Nets
+3.3V: C7.1 C17.1 C21.+ C44.1 IC3.14(SYNC/PDWN) IC3.15(RESET) IC3.16(DVDD) IC5.3(VO) IC6.1(VDD1) IC6.7(VE1)
+5VA: C5.2 C6.1 C8.1 C15.1 C26.1 C27.+ C34.2 C35.1 C39.1 C49.2 C50.1 C55.1 C65.2 C66.1 C70.1 C79.2 C80.1 C84.1 C93.2 C94.1 C98.1 C107.2 C108.1 C112.1 C121.2 C122.1 C126.1 D1.2(C) D2.2(C) D3.2(C) D4.2(C) D5.2(C) D6.2(C) D7.2(C) D8.2(C) D9.2(C) D10.2(C) D11.2(C) D12.2(C) D13.2(C) D14.2(C) D15.2(C) D16.2(C) D17.2(C) D18.2(C) D19.2(C) D20.2(C) D21.2(C) D22.2(C) D23.2(C) D24.2(C) D25.2(C) D26.2(C) D27.2(C) D28.2(C) D29.2(C) D30.2(C) D31.2(C) D32.2(C) IC1.8(+VS) IC2.4(+VS) IC3.1(AVDD) IC4.5(+VS) IC7.1(VIN) IC8.8(+VS) IC9.4(+VS) IC10.5(+VS) IC11.8(+VS) IC12.4(+VS) IC13.5(+VS) IC14.8(+VS) IC15.4(+VS) IC16.5(+VS) IC17.8(+VS) IC18.4(+VS) IC19.5(+VS) IC20.8(+VS) IC21.4(+VS) IC22.5(+VS) IC23.8(+VS) IC24.4(+VS) IC25.5(+VS) IC26.8(+VS) IC27.4(+VS) IC28.5(+VS) L1.1
-5VA: C4.1 C11.2 C28.2 C29.- C33.1 C36.2 C48.1 C51.2 C64.1 C67.2 C78.1 C81.2 C92.1 C95.2 C106.1 C109.2 C120.1 C123.2 D1.1(A) D2.1(A) D3.1(A) D4.1(A) D5.1(A) D6.1(A) D7.1(A) D8.1(A) D9.1(A) D10.1(A) D11.1(A) D12.1(A) D13.1(A) D14.1(A) D15.1(A) D16.1(A) D17.1(A) D18.1(A) D19.1(A) D20.1(A) D21.1(A) D22.1(A) D23.1(A) D24.1(A) D25.1(A) D26.1(A) D27.1(A) D28.1(A) D29.1(A) D30.1(A) D31.1(A) D32.1(A) IC1.5(-VS) IC2.11(-VS) IC8.5(-VS) IC9.11(-VS) IC11.5(-VS) IC12.11(-VS) IC14.5(-VS) IC15.11(-VS) IC17.5(-VS) IC18.11(-VS) IC20.5(-VS) IC21.11(-VS) IC23.5(-VS) IC24.11(-VS) IC26.5(-VS) IC27.11(-VS) L2.1
CH1SW1: IC2.7(OUT2) R11.1 R12.2 R20.2
CH1SW2: IC9.7(OUT2) R35.1 R36.2 R38.2
CH1SW3: IC12.7(OUT2) R55.1 R56.2 R58.2
CH1SW4: IC15.7(OUT2) R75.1 R76.2 R78.2
CH1SW5: IC18.7(OUT2) R95.1 R96.2 R98.2
CH1SW6: IC21.7(OUT2) R115.1 R116.2 R118.2
CH1SW7: IC24.7(OUT2) R135.1 R136.2 R138.2
CH1SW8: IC27.7(OUT2) R155.1 R156.2 R158.2
GND: C2.2 C3.1 C4.2 C5.1 C6.2 C7.2 C8.2 C9.2 C10.2 C11.1 C14.2 C15.2 C16.2 C17.2 C19.1 C20.- C21.- C22.- C23.+ C24.2 C25.1 C26.2 C27.- C28.1 C29.+ C31.2 C32.1 C33.2 C34.1 C35.2 C36.1 C39.2 C40.1 C41.2 C43.1 C44.2 C46.2 C47.1 C48.2 C49.1 C50.2 C51.1 C52.1 C55.2 C57.1 C58.2 C60.1 C62.2 C63.1 C64.2 C65.1 C66.2 C67.1 C70.2 C71.1 C72.2 C74.1 C76.2 C77.1 C78.2 C79.1 C80.2 C81.1 C84.2 C85.1 C86.2 C88.1 C90.2 C91.1 C92.2 C93.1 C94.2 C95.1 C98.2 C99.1 C100.2 C102.1 C104.2 C105.1 C106.2 C107.1 C108.2 C109.1 C112.2 C113.1 C114.2 C116.1 C118.2 C119.1 C120.2 C121.1 C122.2 C123.1 C126.2 C127.1 C128.2 C130.1 COM.1 COM.2 G1.6(COM) IC1.6(REF) IC3.2(AGND) IC3.3(VREFN) IC3.17(DGND) IC3.20(CS) IC4.2(-VS) IC5.1(GND) IC6.2(GND1) IC6.8(GND1_) IC7.3(GND) IC8.6(REF) IC10.2(-VS) IC11.6(REF) IC13.2(-VS) IC14.6(REF) IC16.2(-VS) IC17.6(REF) IC19.2(-VS) IC20.6(REF) IC22.2(-VS) IC23.6(REF) IC25.2(-VS) IC26.6(REF) IC28.2(-VS) R8.2 R9.2 R10.1 R13.2 R21.2 R32.2 R33.2 R34.1 R37.2 R42.2 R52.2 R53.2 R54.1 R57.2 R62.2 R72.2 R73.2 R74.1 R77.2 R82.2 R92.2 R93.2 R94.1 R97.2 R102.2 R112.2 R113.2 R114.1 R117.2 R122.2 R132.2 R133.2 R134.1 R137.2 R142.2 R152.2 R153.2 R154.1 R157.2 R162.2
N$1: IN1.3 R3.1
N$2: IN1.2 R4.1
N$3: IN1.4 R1.1
N$4: IN1.1 R2.1
N$5: IC1.1(-IN) R5.2
N$6: IC1.4(+IN) R6.2
N$7: C1.1 C2.1 D1.3(AC) R1.2 R5.1
N$8: C1.2 C3.2 D2.3(AC) R2.2 R6.1
N$9: IC1.2(-RG) IC2.10(+IN3) R7.2
N$10: IC1.3(+RG) IC2.12(+IN4) R7.1
N$11: IC3.21(DRDY) R14.1
N$12: C10.1 IC3.18(XTAL2) Q1.1
N$13: C9.1 IC3.19(XTAL1/CLKIN) Q1.2
N$14: IC3.24(SCLK) R15.1
N$15: C13.2 IC2.5(+IN2) R13.1
N$16: IC2.6(-IN2) R10.2 R11.2
N$17: C12.2 C13.1 R12.1
N$18: C12.1 IC1.7(OUT)
N$19: IC2.2(-IN1) R21.1 R23.1
N$20: C14.1 IC2.3(+IN1) R19.1
N$21: IC4.1(OUT) R18.2 R25.2
N$22: IC3.23(DIN) R16.1
N$23: IC3.22(DOUT) R17.1
N$26: D4.3(AC) IC2.13(-IN4) IC2.14(OUT4) R4.2 R9.1
N$27: D3.3(AC) IC2.8(OUT3) IC2.9(-IN3) R3.2 R8.1
N$28: C19.2 IC3.6(AIN0) R18.1
N$29: C56.1 R19.2 R20.1
N$30: IC4.4(-IN) R22.1 R25.1
N$31: IN2.3 R27.1
N$32: IC6.3(VIA) R14.2
N$33: IC6.4(VIB) R17.2
N$34: IC6.5(VOC) R15.2
N$35: IC6.6(VOD) R16.2
N$36: G1.1(+VIN) INT.1
N$37: C18.2 G1.2(-VIN) IC6.9(GND2_) IC6.15(GND2) INT.3 INT.8
N$38: C18.1 IC6.10(VE2) IC6.16(VDD2) INT.2
N$39: C22.+ C24.1 G1.7(+VOUT) IC5.2@1(VI1) L1.2
N$40: IC6.11(VID) INT.7
N$41: IC6.12(VIC) INT.6
N$42: IC6.13(VOB) INT.5
N$43: IC6.14(VOA) INT.4
N$44: C23.- C25.2 G1.5(-VOUT) L2.2
N$45: IN2.2 R28.1
N$46: IN2.4 R24.1
N$47: IN2.1 R26.1
N$48: IC8.1(-IN) R29.2
N$49: C30.1 C31.1 D5.3(AC) R24.2 R29.1
N$50: C30.2 C32.2 D6.3(AC) R26.2 R30.1
N$51: IC8.2(-RG) IC9.10(+IN3) R31.2
N$52: IC8.3(+RG) IC9.12(+IN4) R31.1
N$53: IC8.4(+IN) R30.2
N$54: D8.3(AC) IC9.13(-IN4) IC9.14(OUT4) R28.2 R33.1
N$55: D7.3(AC) IC9.8(OUT3) IC9.9(-IN3) R27.2 R32.1
N$56: C38.2 IC9.5(+IN2) R37.1
N$57: IC9.6(-IN2) R34.2 R35.2
N$58: C37.2 C38.1 R36.1
N$59: C37.1 IC8.7(OUT)
N$60: C41.1 IC9.3(+IN1) R41.1
N$61: IC10.4(-IN) R39.1 R40.1
N$62: IC10.1(OUT) R40.2 R44.2
N$63: C56.2 IC2.1(OUT1) R22.2 R23.2
N$64: IC9.2(-IN1) R42.1 R43.1
N$65: C42.1 R38.1 R41.2
N$66: C42.2 IC9.1(OUT1) R39.2 R43.2
N$67: C43.2 IC3.7(AIN1) R44.1
N$68: IN3.3 R47.1
N$69: IN3.2 R48.1
N$70: IN3.4 R45.1
N$71: IN3.1 R46.1
N$72: IC11.1(-IN) R49.2
N$73: C45.1 C46.1 D9.3(AC) R45.2 R49.1
N$74: C45.2 C47.2 D10.3(AC) R46.2 R50.1
N$75: IC11.2(-RG) IC12.10(+IN3) R51.2
N$76: IC11.3(+RG) IC12.12(+IN4) R51.1
N$77: IC11.4(+IN) R50.2
N$78: D12.3(AC) IC12.13(-IN4) IC12.14(OUT4) R48.2 R53.1
N$79: D11.3(AC) IC12.8(OUT3) IC12.9(-IN3) R47.2 R52.1
N$80: C54.2 IC12.5(+IN2) R57.1
N$81: IC12.6(-IN2) R54.2 R55.2
N$82: C53.2 C54.1 R56.1
N$83: C53.1 IC11.7(OUT)
N$84: C58.1 IC12.3(+IN1) R61.1
N$85: IC13.4(-IN) R59.1 R60.1
N$86: IC13.1(OUT) R60.2 R64.2
N$87: IC12.2(-IN1) R62.1 R63.1
N$88: C59.1 R58.1 R61.2
N$89: C59.2 IC12.1(OUT1) R59.2 R63.2
N$90: C60.2 IC3.8(AIN2) R64.1
N$91: C116.2 IC3.12(AIN6) R144.1
N$92: IN5.3 R87.1
N$93: IN4.3 R67.1
N$94: IN4.2 R68.1
N$95: IN4.4 R65.1
N$96: IN4.1 R66.1
N$97: IC14.1(-IN) R69.2
N$98: C61.1 C62.1 D13.3(AC) R65.2 R69.1
N$99: C61.2 C63.2 D14.3(AC) R66.2 R70.1
N$100: IC14.2(-RG) IC15.10(+IN3) R71.2
N$101: IC14.3(+RG) IC15.12(+IN4) R71.1
N$102: IC14.4(+IN) R70.2
N$103: D16.3(AC) IC15.13(-IN4) IC15.14(OUT4) R68.2 R73.1
N$104: D15.3(AC) IC15.8(OUT3) IC15.9(-IN3) R67.2 R72.1
N$105: C69.2 IC15.5(+IN2) R77.1
N$106: IC15.6(-IN2) R74.2 R75.2
N$107: C68.2 C69.1 R76.1
N$108: C68.1 IC14.7(OUT)
N$109: C72.1 IC15.3(+IN1) R81.1
N$110: IC16.4(-IN) R79.1 R80.1
N$111: IC16.1(OUT) R80.2 R84.2
N$112: IC15.2(-IN1) R82.1 R83.1
N$113: C73.1 R78.1 R81.2
N$114: C73.2 IC15.1(OUT1) R79.2 R83.2
N$115: C74.2 IC3.9(AIN3) R84.1
N$116: IN5.2 R88.1
N$117: IN5.4 R85.1
N$118: IN5.1 R86.1
N$119: IC17.1(-IN) R89.2
N$120: C75.1 C76.1 D17.3(AC) R85.2 R89.1
N$121: C75.2 C77.2 D18.3(AC) R86.2 R90.1
N$122: IC17.2(-RG) IC18.10(+IN3) R91.2
N$123: IC17.3(+RG) IC18.12(+IN4) R91.1
N$124: IC17.4(+IN) R90.2
N$125: D20.3(AC) IC18.13(-IN4) IC18.14(OUT4) R88.2 R93.1
N$126: D19.3(AC) IC18.8(OUT3) IC18.9(-IN3) R87.2 R92.1
N$127: C83.2 IC18.5(+IN2) R97.1
N$128: IC18.6(-IN2) R94.2 R95.2
N$129: C82.2 C83.1 R96.1
N$130: C82.1 IC17.7(OUT)
N$131: C86.1 IC18.3(+IN1) R101.1
N$132: IC19.4(-IN) R99.1 R100.1
N$133: IC19.1(OUT) R100.2 R104.2
N$134: IC18.2(-IN1) R102.1 R103.1
N$135: C87.1 R98.1 R101.2
N$136: C87.2 IC18.1(OUT1) R99.2 R103.2
N$137: C88.2 IC3.10(AIN4) R104.1
N$138: IN6.3 R107.1
N$139: IN6.2 R108.1
N$140: IN6.4 R105.1
N$141: IN6.1 R106.1
N$142: IC20.1(-IN) R109.2
N$143: C89.1 C90.1 D21.3(AC) R105.2 R109.1
N$144: C89.2 C91.2 D22.3(AC) R106.2 R110.1
N$145: IC20.2(-RG) IC21.10(+IN3) R111.2
N$146: IC20.3(+RG) IC21.12(+IN4) R111.1
N$147: IC20.4(+IN) R110.2
N$148: D24.3(AC) IC21.13(-IN4) IC21.14(OUT4) R108.2 R113.1
N$149: D23.3(AC) IC21.8(OUT3) IC21.9(-IN3) R107.2 R112.1
N$150: C97.2 IC21.5(+IN2) R117.1
N$151: IC21.6(-IN2) R114.2 R115.2
N$152: C96.2 C97.1 R116.1
N$153: C96.1 IC20.7(OUT)
N$154: C100.1 IC21.3(+IN1) R121.1
N$155: IC22.4(-IN) R119.1 R120.1
N$156: IC22.1(OUT) R120.2 R124.2
N$157: IC21.2(-IN1) R122.1 R123.1
N$158: C101.1 R118.1 R121.2
N$159: C101.2 IC21.1(OUT1) R119.2 R123.2
N$160: C102.2 IC3.11(AIN5) R124.1
N$161: IN7.3 R127.1
N$162: IN7.2 R128.1
N$163: IN7.4 R125.1
N$164: IN7.1 R126.1
N$165: IC23.1(-IN) R129.2
N$166: C103.1 C104.1 D25.3(AC) R125.2 R129.1
N$167: C103.2 C105.2 D26.3(AC) R126.2 R130.1
N$168: IC23.2(-RG) IC24.10(+IN3) R131.2
N$169: IC23.3(+RG) IC24.12(+IN4) R131.1
N$170: IC23.4(+IN) R130.2
N$171: D28.3(AC) IC24.13(-IN4) IC24.14(OUT4) R128.2 R133.1
N$172: D27.3(AC) IC24.8(OUT3) IC24.9(-IN3) R127.2 R132.1
N$173: C111.2 IC24.5(+IN2) R137.1
N$174: IC24.6(-IN2) R134.2 R135.2
N$175: C110.2 C111.1 R136.1
N$176: C110.1 IC23.7(OUT)
N$177: C114.1 IC24.3(+IN1) R141.1
N$178: IC25.4(-IN) R139.1 R140.1
N$179: IC25.1(OUT) R140.2 R144.2
N$180: IC24.2(-IN1) R142.1 R143.1
N$181: C115.1 R138.1 R141.2
N$182: C115.2 IC24.1(OUT1) R139.2 R143.2
N$184: C130.2 IC3.13(AIN7) R164.1
N$185: IN8.3 R147.1
N$186: IN8.2 R148.1
N$187: IN8.4 R145.1
N$188: IN8.1 R146.1
N$189: IC26.1(-IN) R149.2
N$190: C117.1 C118.1 D29.3(AC) R145.2 R149.1
N$191: C117.2 C119.2 D30.3(AC) R146.2 R150.1
N$192: IC26.2(-RG) IC27.10(+IN3) R151.2
N$193: IC26.3(+RG) IC27.12(+IN4) R151.1
N$194: IC26.4(+IN) R150.2
N$195: D32.3(AC) IC27.13(-IN4) IC27.14(OUT4) R148.2 R153.1
N$196: D31.3(AC) IC27.8(OUT3) IC27.9(-IN3) R147.2 R152.1
N$197: C125.2 IC27.5(+IN2) R157.1
N$198: IC27.6(-IN2) R154.2 R155.2
N$199: C124.2 C125.1 R156.1
N$200: C124.1 IC26.7(OUT)
N$201: C128.1 IC27.3(+IN1) R161.1
N$202: IC28.4(-IN) R159.1 R160.1
N$203: IC28.1(OUT) R160.2 R164.2
N$204: IC27.2(-IN1) R162.1 R163.1
N$205: C129.1 R158.1 R161.2
N$206: C129.2 IC27.1(OUT1) R159.2 R163.2
VREF: C16.1 C20.+ C40.2 C52.2 C57.2 C71.2 C85.2 C99.2 C113.2 C127.2 IC3.4(VREFP) IC3.5(AINCOM) IC4.3(+IN) IC7.2(VOUT) IC10.3(+IN) IC13.3(+IN) IC16.3(+IN) IC19.3(+IN) IC22.3(+IN) IC25.3(+IN) IC28.3(+IN)
Unconnected: IC3.25(D0/CLKOUT) IC3.26(D1) IC3.27(D2) IC3.28(D3) IC5.2(VI)

## Library data of the parts
C1-C19 C24-C26 C28 C30-C130 = rcl:C-EU: CAPACITOR, European symbol
C20-C23 C27 C29 = rcl:CPOL-EU: POLARIZED CAPACITOR, European symbol
COM = pinhead:PINHD-1X2: PIN HEADER
D1-D32 = diode:BAV199: DIODE low-leakage double diode
G1 = nanoeeg:TMV0505D
IC1 IC8 IC11 IC14 IC17 IC20 IC23 IC26 = nanoeeg:AD8221ARZ
IC2 IC9 IC12 IC15 IC18 IC21 IC24 IC27 = nanoeeg:TLC2254ID
IC3 = nanoeeg:ADS1256IDBT
IC4 IC10 IC13 IC16 IC19 IC22 IC25 IC28 = nanoeeg:AD8605ARTZ
IC5 = linear:MCP1703*: 250 mA, 16V, Low Quiescent Current LDO Regulator Source: http://ww1.microchip.com/downloads/en/DeviceDoc/22049b.pdf
IC6 = nanoeeg:ADUM1402ARWZ
IC7 = nanoeeg:REF3125AIDBZT
IN1-IN8 = pinhead:PINHD-1X4: PIN HEADER
INT = pinhead:PINHD-1X8: PIN HEADER
L1 L2 = rcl:L-US: INDUCTOR, American symbol
Q1 = crystal:CRYSTAL: CRYSTAL; OC_FARNELL: 1666969; OC_NEWARK: unknown
R1-R164 = rcl:R-EU_: RESISTOR, European symbol